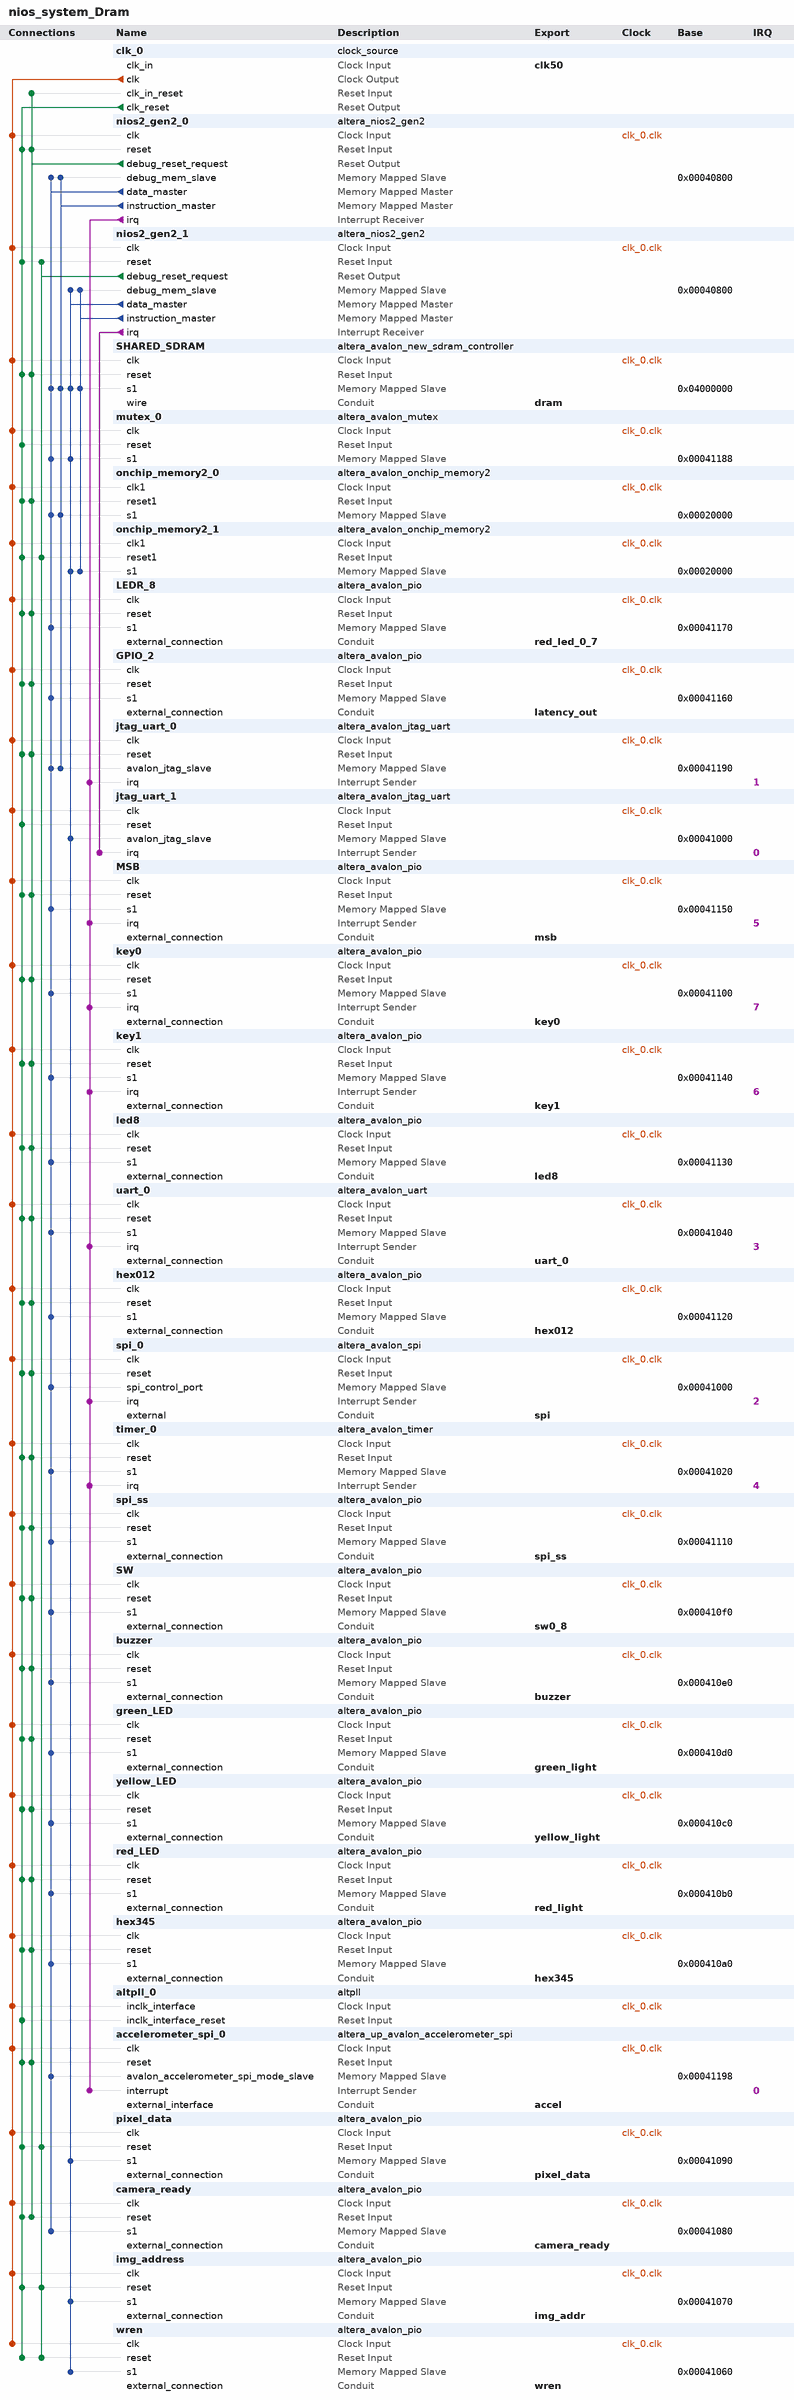
[diagram p0: system contents]
# Platform Designer (Qsys) system nios_system_Dram, MAX 10 10M50DAF484C7G
# Parameters at their usual value, and those the tool derives, are not listed.
package require -exact qsys 18.1
create_system nios_system_Dram
set_project_property DEVICE_FAMILY {MAX 10}
set_project_property DEVICE 10M50DAF484C7G

add_instance clk_0 clock_source 18.1
set_instance_parameter_value clk_0 clockFrequency 50000000

add_instance nios2_gen2_0 altera_nios2_gen2 18.1
set_instance_parameter_value nios2_gen2_0 dcache_size 2048
set_instance_parameter_value nios2_gen2_0 exceptionSlave onchip_memory2_0.s1
set_instance_parameter_value nios2_gen2_0 icache_size 4096
set_instance_parameter_value nios2_gen2_0 impl Tiny
set_instance_parameter_value nios2_gen2_0 resetSlave onchip_memory2_0.s1

add_instance nios2_gen2_1 altera_nios2_gen2 18.1
set_instance_parameter_value nios2_gen2_1 cpuID 1
set_instance_parameter_value nios2_gen2_1 dcache_size 2048
set_instance_parameter_value nios2_gen2_1 exceptionSlave onchip_memory2_1.s1
set_instance_parameter_value nios2_gen2_1 icache_size 4096
set_instance_parameter_value nios2_gen2_1 impl Fast
set_instance_parameter_value nios2_gen2_1 resetSlave onchip_memory2_1.s1

add_instance SHARED_SDRAM altera_avalon_new_sdram_controller 18.1
set_instance_parameter_value SHARED_SDRAM TAC 5.5
set_instance_parameter_value SHARED_SDRAM TRCD 20.0
set_instance_parameter_value SHARED_SDRAM TRP 20.0
set_instance_parameter_value SHARED_SDRAM casLatency 3
set_instance_parameter_value SHARED_SDRAM columnWidth 10
set_instance_parameter_value SHARED_SDRAM dataWidth 16
set_instance_parameter_value SHARED_SDRAM generateSimulationModel false
set_instance_parameter_value SHARED_SDRAM model single_Micron_MT48LC4M32B2_7_chip
set_instance_parameter_value SHARED_SDRAM numberOfBanks 4
set_instance_parameter_value SHARED_SDRAM numberOfChipSelects 1
set_instance_parameter_value SHARED_SDRAM powerUpDelay 100.0
set_instance_parameter_value SHARED_SDRAM refreshPeriod 15.625
set_instance_parameter_value SHARED_SDRAM rowWidth 13

add_instance mutex_0 altera_avalon_mutex 18.1

add_instance onchip_memory2_0 altera_avalon_onchip_memory2 18.1
set_instance_parameter_value onchip_memory2_0 dataWidth 32
set_instance_parameter_value onchip_memory2_0 dualPort false
set_instance_parameter_value onchip_memory2_0 initMemContent false
set_instance_parameter_value onchip_memory2_0 initializationFileName onchip_mem.hex
set_instance_parameter_value onchip_memory2_0 memorySize 65536

add_instance onchip_memory2_1 altera_avalon_onchip_memory2 18.1
set_instance_parameter_value onchip_memory2_1 dataWidth 32
set_instance_parameter_value onchip_memory2_1 dualPort false
set_instance_parameter_value onchip_memory2_1 initMemContent false
set_instance_parameter_value onchip_memory2_1 initializationFileName onchip_mem.hex
set_instance_parameter_value onchip_memory2_1 memorySize 32768

add_instance LEDR_8 altera_avalon_pio 18.1
set_instance_parameter_value LEDR_8 direction Output
set_instance_parameter_value LEDR_8 width 8

add_instance GPIO_2 altera_avalon_pio 18.1
set_instance_parameter_value GPIO_2 direction Output
set_instance_parameter_value GPIO_2 width 1

add_instance jtag_uart_0 altera_avalon_jtag_uart 18.1
set_instance_parameter_value jtag_uart_0 simInteractiveOptions NO_INTERACTIVE_WINDOWS

add_instance jtag_uart_1 altera_avalon_jtag_uart 18.1
set_instance_parameter_value jtag_uart_1 simInteractiveOptions NO_INTERACTIVE_WINDOWS

add_instance MSB altera_avalon_pio 18.1
set_instance_parameter_value MSB captureEdge true
set_instance_parameter_value MSB direction Input
set_instance_parameter_value MSB generateIRQ true
set_instance_parameter_value MSB irqType EDGE
set_instance_parameter_value MSB width 1

add_instance key0 altera_avalon_pio 18.1
set_instance_parameter_value key0 captureEdge true
set_instance_parameter_value key0 direction Input
set_instance_parameter_value key0 generateIRQ true
set_instance_parameter_value key0 irqType EDGE
set_instance_parameter_value key0 width 1

add_instance key1 altera_avalon_pio 18.1
set_instance_parameter_value key1 captureEdge true
set_instance_parameter_value key1 direction Input
set_instance_parameter_value key1 generateIRQ true
set_instance_parameter_value key1 irqType EDGE
set_instance_parameter_value key1 width 1

add_instance led8 altera_avalon_pio 18.1
set_instance_parameter_value led8 direction Output
set_instance_parameter_value led8 width 1

add_instance uart_0 altera_avalon_uart 18.1
set_instance_parameter_value uart_0 baud 9600
set_instance_parameter_value uart_0 dataBits 8
set_instance_parameter_value uart_0 fixedBaud true
set_instance_parameter_value uart_0 parity NONE
set_instance_parameter_value uart_0 stopBits 1

add_instance hex012 altera_avalon_pio 18.1
set_instance_parameter_value hex012 direction Output
set_instance_parameter_value hex012 width 24

add_instance spi_0 altera_avalon_spi 18.1
set_instance_parameter_value spi_0 clockPolarity 0
set_instance_parameter_value spi_0 dataWidth 8
set_instance_parameter_value spi_0 masterSPI true
set_instance_parameter_value spi_0 numberOfSlaves 1
set_instance_parameter_value spi_0 targetClockRate 128000

add_instance timer_0 altera_avalon_timer 18.1
set_instance_parameter_value timer_0 period 1
set_instance_parameter_value timer_0 periodUnits MSEC

add_instance spi_ss altera_avalon_pio 18.1
set_instance_parameter_value spi_ss direction Output
set_instance_parameter_value spi_ss width 1

add_instance SW altera_avalon_pio 18.1
set_instance_parameter_value SW direction Input
set_instance_parameter_value SW width 9

add_instance buzzer altera_avalon_pio 18.1
set_instance_parameter_value buzzer direction Output
set_instance_parameter_value buzzer width 1

add_instance green_LED altera_avalon_pio 18.1
set_instance_parameter_value green_LED direction Output
set_instance_parameter_value green_LED width 1

add_instance yellow_LED altera_avalon_pio 18.1
set_instance_parameter_value yellow_LED direction Output
set_instance_parameter_value yellow_LED width 1

add_instance red_LED altera_avalon_pio 18.1
set_instance_parameter_value red_LED direction Output
set_instance_parameter_value red_LED width 1

add_instance hex345 altera_avalon_pio 18.1
set_instance_parameter_value hex345 direction Output
set_instance_parameter_value hex345 width 24

add_instance altpll_0 altpll 18.1
set_instance_parameter_value altpll_0 CLK0_DIVIDE_BY 1
set_instance_parameter_value altpll_0 CLK0_MULTIPLY_BY 1
set_instance_parameter_value altpll_0 CLK1_DIVIDE_BY 2
set_instance_parameter_value altpll_0 CLK1_DUTY_CYCLE 50
set_instance_parameter_value altpll_0 CLK1_MULTIPLY_BY 1
set_instance_parameter_value altpll_0 CLK1_PHASE_SHIFT 0
set_instance_parameter_value altpll_0 COMPENSATE_CLOCK CLK1
set_instance_parameter_value altpll_0 INCLK0_INPUT_FREQUENCY 20000
set_instance_parameter_value altpll_0 PORT_ARESET PORT_UNUSED
set_instance_parameter_value altpll_0 PORT_LOCKED PORT_UNUSED
set_instance_parameter_value altpll_0 PORT_clk1 PORT_USED
set_instance_parameter_value altpll_0 PORT_clk2 PORT_UNUSED
set_instance_parameter_value altpll_0 PORT_clk3 PORT_UNUSED

add_instance accelerometer_spi_0 altera_up_avalon_accelerometer_spi 18.0

add_instance pixel_data altera_avalon_pio 18.1
set_instance_parameter_value pixel_data direction Output
set_instance_parameter_value pixel_data width 4

add_instance camera_ready altera_avalon_pio 18.1
set_instance_parameter_value camera_ready direction Input
set_instance_parameter_value camera_ready width 1

add_instance img_address altera_avalon_pio 18.1
set_instance_parameter_value img_address direction Output
set_instance_parameter_value img_address width 17

add_instance wren altera_avalon_pio 18.1
set_instance_parameter_value wren direction Output
set_instance_parameter_value wren width 1

# connections
add_connection clk_0.clk accelerometer_spi_0.clk clock
add_connection clk_0.clk altpll_0.inclk_interface clock
add_connection clk_0.clk buzzer.clk clock
add_connection clk_0.clk camera_ready.clk clock
add_connection clk_0.clk GPIO_2.clk clock
add_connection clk_0.clk green_LED.clk clock
add_connection clk_0.clk hex012.clk clock
add_connection clk_0.clk hex345.clk clock
add_connection clk_0.clk img_address.clk clock
add_connection clk_0.clk jtag_uart_0.clk clock
add_connection clk_0.clk jtag_uart_1.clk clock
add_connection clk_0.clk key0.clk clock
add_connection clk_0.clk key1.clk clock
add_connection clk_0.clk led8.clk clock
add_connection clk_0.clk LEDR_8.clk clock
add_connection clk_0.clk MSB.clk clock
add_connection clk_0.clk mutex_0.clk clock
add_connection clk_0.clk nios2_gen2_0.clk clock
add_connection clk_0.clk nios2_gen2_1.clk clock
add_connection clk_0.clk onchip_memory2_0.clk1 clock
add_connection clk_0.clk onchip_memory2_1.clk1 clock
add_connection clk_0.clk pixel_data.clk clock
add_connection clk_0.clk red_LED.clk clock
add_connection clk_0.clk SHARED_SDRAM.clk clock
add_connection clk_0.clk spi_0.clk clock
add_connection clk_0.clk spi_ss.clk clock
add_connection clk_0.clk SW.clk clock
add_connection clk_0.clk timer_0.clk clock
add_connection clk_0.clk uart_0.clk clock
add_connection clk_0.clk wren.clk clock
add_connection clk_0.clk yellow_LED.clk clock
add_connection clk_0.clk_reset accelerometer_spi_0.reset reset
add_connection clk_0.clk_reset altpll_0.inclk_interface_reset reset
add_connection clk_0.clk_reset buzzer.reset reset
add_connection clk_0.clk_reset camera_ready.reset reset
add_connection clk_0.clk_reset GPIO_2.reset reset
add_connection clk_0.clk_reset green_LED.reset reset
add_connection clk_0.clk_reset hex012.reset reset
add_connection clk_0.clk_reset hex345.reset reset
add_connection clk_0.clk_reset img_address.reset reset
add_connection clk_0.clk_reset jtag_uart_0.reset reset
add_connection clk_0.clk_reset jtag_uart_1.reset reset
add_connection clk_0.clk_reset key0.reset reset
add_connection clk_0.clk_reset key1.reset reset
add_connection clk_0.clk_reset led8.reset reset
add_connection clk_0.clk_reset LEDR_8.reset reset
add_connection clk_0.clk_reset MSB.reset reset
add_connection clk_0.clk_reset mutex_0.reset reset
add_connection clk_0.clk_reset nios2_gen2_0.reset reset
add_connection clk_0.clk_reset nios2_gen2_1.reset reset
add_connection clk_0.clk_reset onchip_memory2_0.reset1 reset
add_connection clk_0.clk_reset onchip_memory2_1.reset1 reset
add_connection clk_0.clk_reset pixel_data.reset reset
add_connection clk_0.clk_reset red_LED.reset reset
add_connection clk_0.clk_reset SHARED_SDRAM.reset reset
add_connection clk_0.clk_reset spi_0.reset reset
add_connection clk_0.clk_reset spi_ss.reset reset
add_connection clk_0.clk_reset SW.reset reset
add_connection clk_0.clk_reset timer_0.reset reset
add_connection clk_0.clk_reset uart_0.reset reset
add_connection clk_0.clk_reset wren.reset reset
add_connection clk_0.clk_reset yellow_LED.reset reset
add_connection nios2_gen2_0.debug_reset_request accelerometer_spi_0.reset reset
add_connection nios2_gen2_0.debug_reset_request buzzer.reset reset
add_connection nios2_gen2_0.debug_reset_request camera_ready.reset reset
add_connection nios2_gen2_0.debug_reset_request clk_0.clk_in_reset reset
add_connection nios2_gen2_0.debug_reset_request GPIO_2.reset reset
add_connection nios2_gen2_0.debug_reset_request green_LED.reset reset
add_connection nios2_gen2_0.debug_reset_request hex012.reset reset
add_connection nios2_gen2_0.debug_reset_request hex345.reset reset
add_connection nios2_gen2_0.debug_reset_request jtag_uart_0.reset reset
add_connection nios2_gen2_0.debug_reset_request key0.reset reset
add_connection nios2_gen2_0.debug_reset_request key1.reset reset
add_connection nios2_gen2_0.debug_reset_request led8.reset reset
add_connection nios2_gen2_0.debug_reset_request LEDR_8.reset reset
add_connection nios2_gen2_0.debug_reset_request MSB.reset reset
add_connection nios2_gen2_0.debug_reset_request nios2_gen2_0.reset reset
add_connection nios2_gen2_0.debug_reset_request onchip_memory2_0.reset1 reset
add_connection nios2_gen2_0.debug_reset_request red_LED.reset reset
add_connection nios2_gen2_0.debug_reset_request SHARED_SDRAM.reset reset
add_connection nios2_gen2_0.debug_reset_request spi_0.reset reset
add_connection nios2_gen2_0.debug_reset_request spi_ss.reset reset
add_connection nios2_gen2_0.debug_reset_request SW.reset reset
add_connection nios2_gen2_0.debug_reset_request timer_0.reset reset
add_connection nios2_gen2_0.debug_reset_request uart_0.reset reset
add_connection nios2_gen2_0.debug_reset_request yellow_LED.reset reset
add_connection nios2_gen2_1.debug_reset_request img_address.reset reset
add_connection nios2_gen2_1.debug_reset_request nios2_gen2_1.reset reset
add_connection nios2_gen2_1.debug_reset_request onchip_memory2_1.reset1 reset
add_connection nios2_gen2_1.debug_reset_request pixel_data.reset reset
add_connection nios2_gen2_1.debug_reset_request wren.reset reset
add_connection nios2_gen2_0.data_master accelerometer_spi_0.avalon_accelerometer_spi_mode_slave avalon
set_connection_parameter_value nios2_gen2_0.data_master/accelerometer_spi_0.avalon_accelerometer_spi_mode_slave baseAddress 0x00041198
add_connection nios2_gen2_0.data_master buzzer.s1 avalon
set_connection_parameter_value nios2_gen2_0.data_master/buzzer.s1 baseAddress 0x000410e0
add_connection nios2_gen2_0.data_master camera_ready.s1 avalon
set_connection_parameter_value nios2_gen2_0.data_master/camera_ready.s1 baseAddress 0x00041080
add_connection nios2_gen2_0.data_master GPIO_2.s1 avalon
set_connection_parameter_value nios2_gen2_0.data_master/GPIO_2.s1 baseAddress 0x00041160
add_connection nios2_gen2_0.data_master green_LED.s1 avalon
set_connection_parameter_value nios2_gen2_0.data_master/green_LED.s1 baseAddress 0x000410d0
add_connection nios2_gen2_0.data_master hex012.s1 avalon
set_connection_parameter_value nios2_gen2_0.data_master/hex012.s1 baseAddress 0x00041120
add_connection nios2_gen2_0.data_master hex345.s1 avalon
set_connection_parameter_value nios2_gen2_0.data_master/hex345.s1 baseAddress 0x000410a0
add_connection nios2_gen2_0.data_master jtag_uart_0.avalon_jtag_slave avalon
set_connection_parameter_value nios2_gen2_0.data_master/jtag_uart_0.avalon_jtag_slave baseAddress 0x00041190
add_connection nios2_gen2_0.data_master key0.s1 avalon
set_connection_parameter_value nios2_gen2_0.data_master/key0.s1 baseAddress 0x00041100
add_connection nios2_gen2_0.data_master key1.s1 avalon
set_connection_parameter_value nios2_gen2_0.data_master/key1.s1 baseAddress 0x00041140
add_connection nios2_gen2_0.data_master led8.s1 avalon
set_connection_parameter_value nios2_gen2_0.data_master/led8.s1 baseAddress 0x00041130
add_connection nios2_gen2_0.data_master LEDR_8.s1 avalon
set_connection_parameter_value nios2_gen2_0.data_master/LEDR_8.s1 baseAddress 0x00041170
add_connection nios2_gen2_0.data_master MSB.s1 avalon
set_connection_parameter_value nios2_gen2_0.data_master/MSB.s1 baseAddress 0x00041150
add_connection nios2_gen2_0.data_master mutex_0.s1 avalon
set_connection_parameter_value nios2_gen2_0.data_master/mutex_0.s1 baseAddress 0x00041188
add_connection nios2_gen2_0.data_master nios2_gen2_0.debug_mem_slave avalon
set_connection_parameter_value nios2_gen2_0.data_master/nios2_gen2_0.debug_mem_slave baseAddress 0x00040800
add_connection nios2_gen2_0.data_master onchip_memory2_0.s1 avalon
set_connection_parameter_value nios2_gen2_0.data_master/onchip_memory2_0.s1 baseAddress 0x00020000
add_connection nios2_gen2_0.data_master red_LED.s1 avalon
set_connection_parameter_value nios2_gen2_0.data_master/red_LED.s1 baseAddress 0x000410b0
add_connection nios2_gen2_0.data_master SHARED_SDRAM.s1 avalon
set_connection_parameter_value nios2_gen2_0.data_master/SHARED_SDRAM.s1 baseAddress 0x04000000
add_connection nios2_gen2_0.data_master spi_0.spi_control_port avalon
set_connection_parameter_value nios2_gen2_0.data_master/spi_0.spi_control_port baseAddress 0x00041000
add_connection nios2_gen2_0.data_master spi_ss.s1 avalon
set_connection_parameter_value nios2_gen2_0.data_master/spi_ss.s1 baseAddress 0x00041110
add_connection nios2_gen2_0.data_master SW.s1 avalon
set_connection_parameter_value nios2_gen2_0.data_master/SW.s1 baseAddress 0x000410f0
add_connection nios2_gen2_0.data_master timer_0.s1 avalon
set_connection_parameter_value nios2_gen2_0.data_master/timer_0.s1 baseAddress 0x00041020
add_connection nios2_gen2_0.data_master uart_0.s1 avalon
set_connection_parameter_value nios2_gen2_0.data_master/uart_0.s1 baseAddress 0x00041040
add_connection nios2_gen2_0.data_master yellow_LED.s1 avalon
set_connection_parameter_value nios2_gen2_0.data_master/yellow_LED.s1 baseAddress 0x000410c0
add_connection nios2_gen2_0.instruction_master jtag_uart_0.avalon_jtag_slave avalon
set_connection_parameter_value nios2_gen2_0.instruction_master/jtag_uart_0.avalon_jtag_slave baseAddress 0x00041190
add_connection nios2_gen2_0.instruction_master nios2_gen2_0.debug_mem_slave avalon
set_connection_parameter_value nios2_gen2_0.instruction_master/nios2_gen2_0.debug_mem_slave baseAddress 0x00040800
add_connection nios2_gen2_0.instruction_master onchip_memory2_0.s1 avalon
set_connection_parameter_value nios2_gen2_0.instruction_master/onchip_memory2_0.s1 baseAddress 0x00020000
add_connection nios2_gen2_0.instruction_master SHARED_SDRAM.s1 avalon
set_connection_parameter_value nios2_gen2_0.instruction_master/SHARED_SDRAM.s1 baseAddress 0x04000000
add_connection nios2_gen2_1.data_master img_address.s1 avalon
set_connection_parameter_value nios2_gen2_1.data_master/img_address.s1 baseAddress 0x00041070
add_connection nios2_gen2_1.data_master jtag_uart_1.avalon_jtag_slave avalon
set_connection_parameter_value nios2_gen2_1.data_master/jtag_uart_1.avalon_jtag_slave baseAddress 0x00041000
add_connection nios2_gen2_1.data_master mutex_0.s1 avalon
set_connection_parameter_value nios2_gen2_1.data_master/mutex_0.s1 baseAddress 0x00041188
add_connection nios2_gen2_1.data_master nios2_gen2_1.debug_mem_slave avalon
set_connection_parameter_value nios2_gen2_1.data_master/nios2_gen2_1.debug_mem_slave baseAddress 0x00040800
add_connection nios2_gen2_1.data_master onchip_memory2_1.s1 avalon
set_connection_parameter_value nios2_gen2_1.data_master/onchip_memory2_1.s1 baseAddress 0x00020000
add_connection nios2_gen2_1.data_master pixel_data.s1 avalon
set_connection_parameter_value nios2_gen2_1.data_master/pixel_data.s1 baseAddress 0x00041090
add_connection nios2_gen2_1.data_master SHARED_SDRAM.s1 avalon
set_connection_parameter_value nios2_gen2_1.data_master/SHARED_SDRAM.s1 baseAddress 0x04000000
add_connection nios2_gen2_1.data_master wren.s1 avalon
set_connection_parameter_value nios2_gen2_1.data_master/wren.s1 baseAddress 0x00041060
add_connection nios2_gen2_1.instruction_master nios2_gen2_1.debug_mem_slave avalon
set_connection_parameter_value nios2_gen2_1.instruction_master/nios2_gen2_1.debug_mem_slave baseAddress 0x00040800
add_connection nios2_gen2_1.instruction_master onchip_memory2_1.s1 avalon
set_connection_parameter_value nios2_gen2_1.instruction_master/onchip_memory2_1.s1 baseAddress 0x00020000
add_connection nios2_gen2_1.instruction_master SHARED_SDRAM.s1 avalon
set_connection_parameter_value nios2_gen2_1.instruction_master/SHARED_SDRAM.s1 baseAddress 0x04000000
add_connection nios2_gen2_0.irq accelerometer_spi_0.interrupt interrupt
set_connection_parameter_value nios2_gen2_0.irq/accelerometer_spi_0.interrupt irqNumber 0
add_connection nios2_gen2_0.irq jtag_uart_0.irq interrupt
set_connection_parameter_value nios2_gen2_0.irq/jtag_uart_0.irq irqNumber 1
add_connection nios2_gen2_0.irq key0.irq interrupt
set_connection_parameter_value nios2_gen2_0.irq/key0.irq irqNumber 7
add_connection nios2_gen2_0.irq key1.irq interrupt
set_connection_parameter_value nios2_gen2_0.irq/key1.irq irqNumber 6
add_connection nios2_gen2_0.irq MSB.irq interrupt
set_connection_parameter_value nios2_gen2_0.irq/MSB.irq irqNumber 5
add_connection nios2_gen2_0.irq spi_0.irq interrupt
set_connection_parameter_value nios2_gen2_0.irq/spi_0.irq irqNumber 2
add_connection nios2_gen2_0.irq timer_0.irq interrupt
set_connection_parameter_value nios2_gen2_0.irq/timer_0.irq irqNumber 4
add_connection nios2_gen2_0.irq uart_0.irq interrupt
set_connection_parameter_value nios2_gen2_0.irq/uart_0.irq irqNumber 3
add_connection nios2_gen2_1.irq jtag_uart_1.irq interrupt
set_connection_parameter_value nios2_gen2_1.irq/jtag_uart_1.irq irqNumber 0

# exported interfaces
add_interface accel conduit end
set_interface_property accel EXPORT_OF accelerometer_spi_0.external_interface
add_interface buzzer conduit end
set_interface_property buzzer EXPORT_OF buzzer.external_connection
add_interface camera_ready conduit end
set_interface_property camera_ready EXPORT_OF camera_ready.external_connection
add_interface clk50 clock sink
set_interface_property clk50 EXPORT_OF clk_0.clk_in
add_interface dram conduit end
set_interface_property dram EXPORT_OF SHARED_SDRAM.wire
add_interface green_light conduit end
set_interface_property green_light EXPORT_OF green_LED.external_connection
add_interface hex012 conduit end
set_interface_property hex012 EXPORT_OF hex012.external_connection
add_interface hex345 conduit end
set_interface_property hex345 EXPORT_OF hex345.external_connection
add_interface img_addr conduit end
set_interface_property img_addr EXPORT_OF img_address.external_connection
add_interface key0 conduit end
set_interface_property key0 EXPORT_OF key0.external_connection
add_interface key1 conduit end
set_interface_property key1 EXPORT_OF key1.external_connection
add_interface latency_out conduit end
set_interface_property latency_out EXPORT_OF GPIO_2.external_connection
add_interface led8 conduit end
set_interface_property led8 EXPORT_OF led8.external_connection
add_interface msb conduit end
set_interface_property msb EXPORT_OF MSB.external_connection
add_interface pixel_data conduit end
set_interface_property pixel_data EXPORT_OF pixel_data.external_connection
add_interface red_led_0_7 conduit end
set_interface_property red_led_0_7 EXPORT_OF LEDR_8.external_connection
add_interface red_light conduit end
set_interface_property red_light EXPORT_OF red_LED.external_connection
add_interface spi conduit end
set_interface_property spi EXPORT_OF spi_0.external
add_interface spi_ss conduit end
set_interface_property spi_ss EXPORT_OF spi_ss.external_connection
add_interface sw0_8 conduit end
set_interface_property sw0_8 EXPORT_OF SW.external_connection
add_interface uart_0 conduit end
set_interface_property uart_0 EXPORT_OF uart_0.external_connection
add_interface wren conduit end
set_interface_property wren EXPORT_OF wren.external_connection
add_interface yellow_light conduit end
set_interface_property yellow_light EXPORT_OF yellow_LED.external_connection

set_interconnect_requirement {$system} qsys_mm.clockCrossingAdapter HANDSHAKE
set_interconnect_requirement {$system} qsys_mm.enableEccProtection FALSE
set_interconnect_requirement {$system} qsys_mm.insertDefaultSlave FALSE
set_interconnect_requirement {$system} qsys_mm.maxAdditionalLatency 1

save_system nios_system_Dram.qsys
